# Altium project IS903.PrjPcb
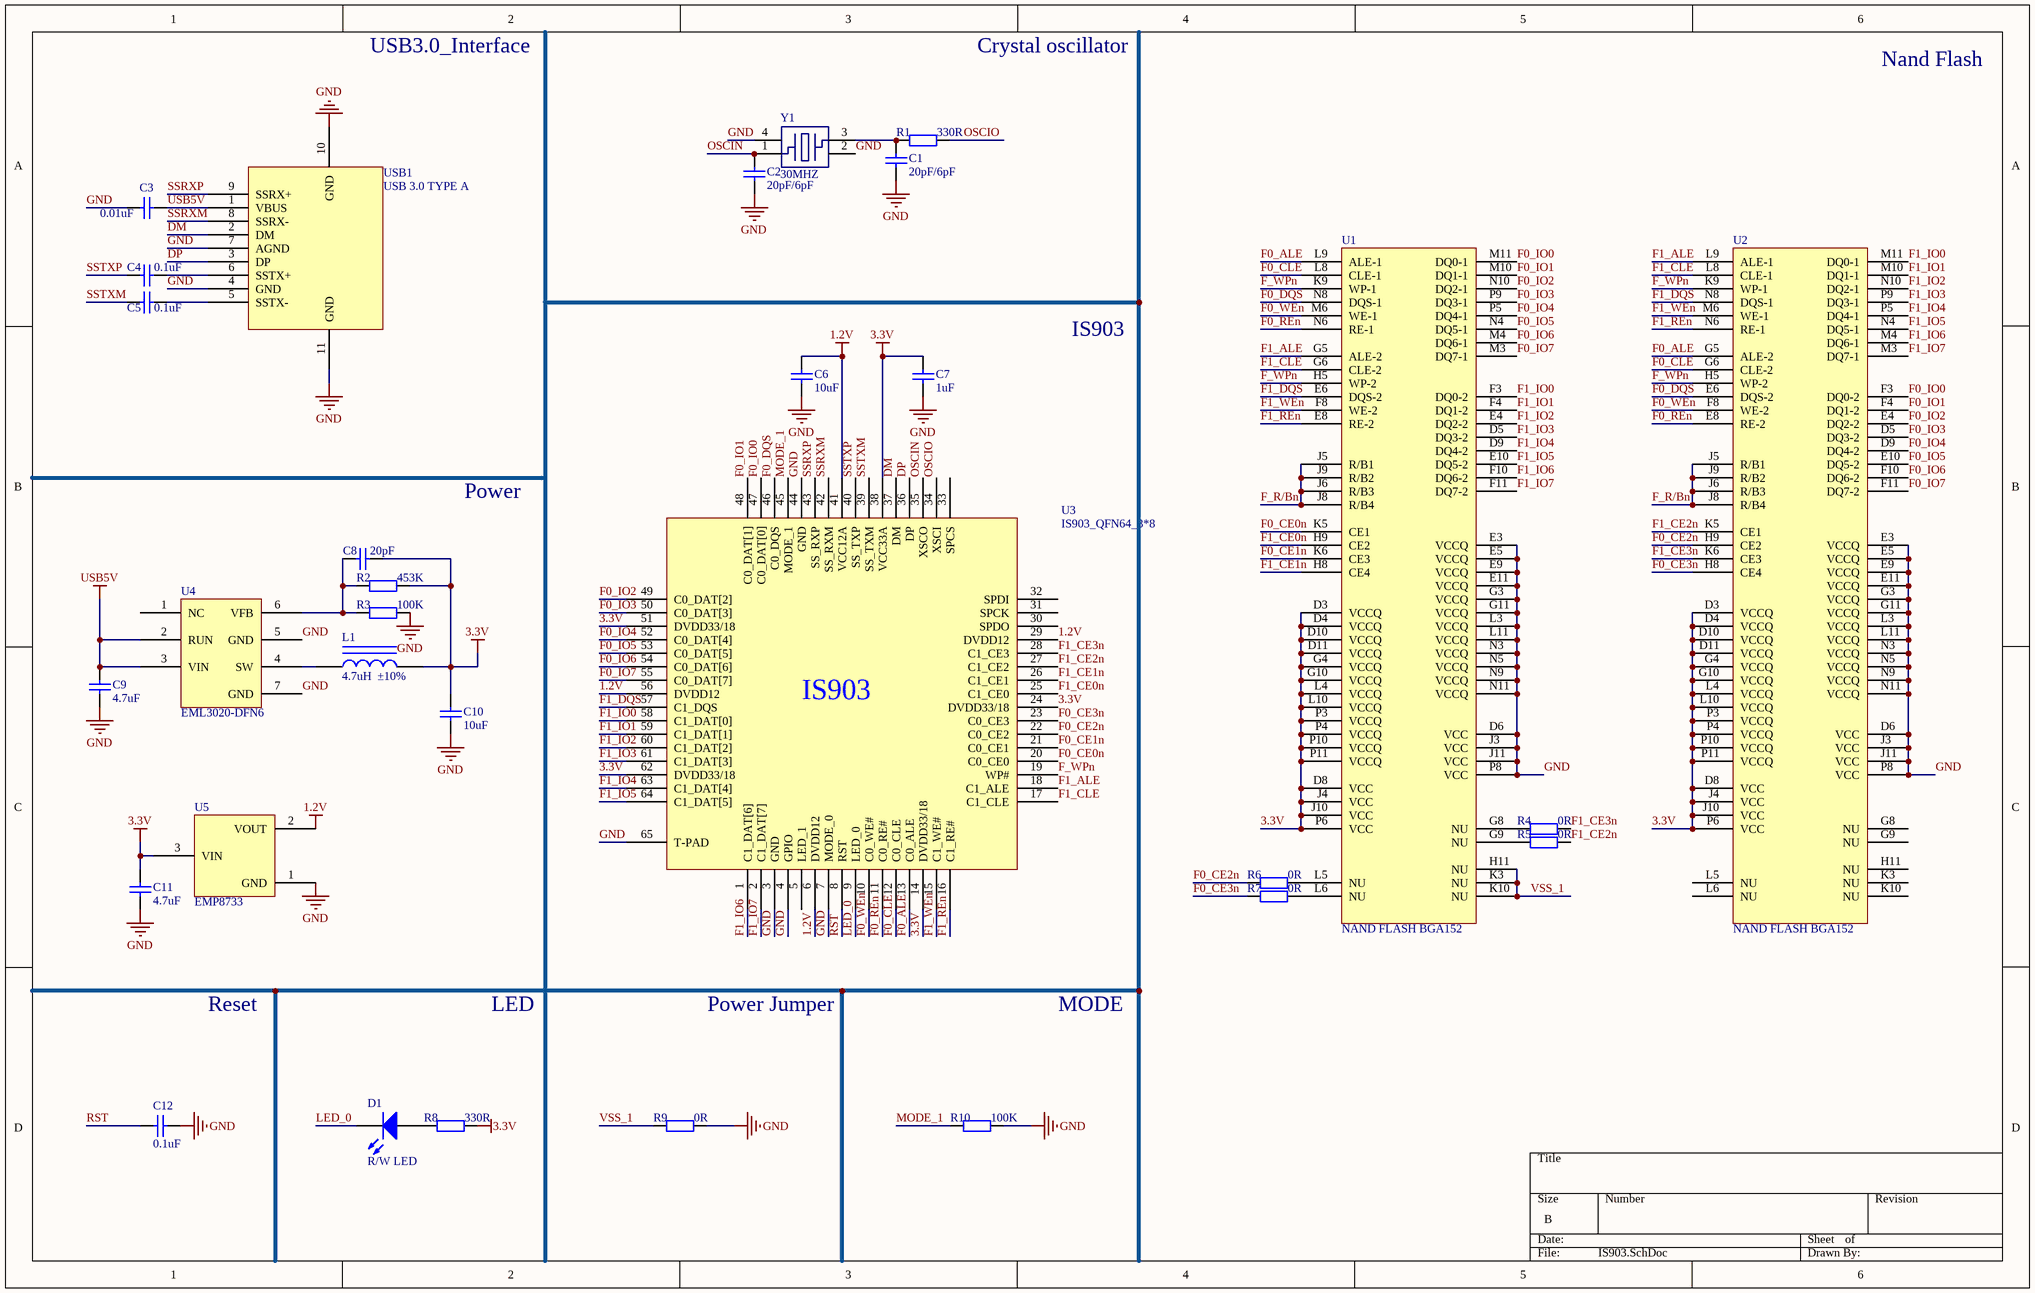
[diagram p0: IS903.SchDoc]
1 sheet, 31 parts. Net scope: global (net labels, ports and power ports of the same name join across sheets).
Board file: IS903_PCB.PcbDoc

## Sheet IS903.SchDoc
size B

### Parts
C1  20pF/6pF  [C 0402_L]
C2  20pF/6pF  [C 0402_L]
C3  0.01uF  [C 0402_L]
C4  0.1uF  [C 0402_L]
C5  0.1uF  [C 0402_L]
C6  10uF  [C 0603_L]
C7  1uF  [C 0402_L]
C8  20pF  [C 0402_L]
C9  4.7uF  [C 0603_L]
C10  10uF  [C 0603_L]
C11  4.7uF  [C 0603_L]
C12  0.1uF  [C 0402_L]
D1  R/W LED  [0603_LED_S1]
L1  4.7uH  ±10%  [LQM2HPN1R0MG0L]
R1  330R  [R 0402_L]
R2  453K  [R 0402_L]
R3  100K  [R 0402_L]
R4  0R  [R 0402_L]
R5  0R  [R 0402_L]
R6  0R  [R 0402_L]
R7  0R  [R 0402_L]
R8  330R  [R 0402_L]
R9  0R  [R 0402_L]
R10  100K  [R 0402_L]
U1  NAND FLASH BGA152  [BGA152]
U2  NAND FLASH BGA152  [BGA152]
U3  IS903_QFN64_8*8  [QFN64 8x8_L]
U4  EML3020-DFN6  [TDFN6]
U5  EMP8733  [SOT23-3L]
USB1  USB 3.0 TYPE A  [USB3.0-G]
Y1  30MHZ  [OSC 2025-4P]

### Nets
1.2V: C6.2 U3.6(DVDD12) U3.29(DVDD12) U3.41(VCC12A) U3.56(DVDD12) U5.2(VOUT)
3.3V: C7.2 C8.1 C10.2 C11.2 L1.2 R2.2 R8.2 U1.D3(VCCQ) U1.D4(VCCQ) U1.D8(VCC) U1.D10(VCCQ) U1.D11(VCCQ) U1.G4(VCCQ) U1.G10(VCCQ) U1.J4(VCC) U1.J10(VCC) U1.L4(VCCQ) U1.L10(VCCQ) U1.P3(VCCQ) U1.P4(VCCQ) U1.P6(VCC) U1.P10(VCCQ) U1.P11(VCCQ) U2.D3(VCCQ) U2.D4(VCCQ) U2.D8(VCC) U2.D10(VCCQ) U2.D11(VCCQ) U2.G4(VCCQ) U2.G10(VCCQ) U2.J4(VCC) U2.J10(VCC) U2.L4(VCCQ) U2.L10(VCCQ) U2.P3(VCCQ) U2.P4(VCCQ) U2.P6(VCC) U2.P10(VCCQ) U2.P11(VCCQ) U3.14(DVDD33/18) U3.24(DVDD33/18) U3.38(VCC33A) U3.51(DVDD33/18) U3.62(DVDD33/18) U5.3(VIN)
GND: C1.2 C2.2 C3.2 C6.1 C7.1 C9.1 C10.1 C11.1 C12.2 R3.2 R9.2 R10.2 U1.D6(VCC) U1.E3(VCCQ) U1.E5(VCCQ) U1.E9(VCCQ) U1.E11(VCCQ) U1.G3(VCCQ) U1.G11(VCCQ) U1.J3(VCC) U1.J11(VCC) U1.L3(VCCQ) U1.L11(VCCQ) U1.N3(VCCQ) U1.N5(VCCQ) U1.N9(VCCQ) U1.N11(VCCQ) U1.P8(VCC) U2.D6(VCC) U2.E3(VCCQ) U2.E5(VCCQ) U2.E9(VCCQ) U2.E11(VCCQ) U2.G3(VCCQ) U2.G11(VCCQ) U2.J3(VCC) U2.J11(VCC) U2.L3(VCCQ) U2.L11(VCCQ) U2.N3(VCCQ) U2.N5(VCCQ) U2.N9(VCCQ) U2.N11(VCCQ) U2.P8(VCC) U3.3(GND) U3.4(GPIO) U3.7(MODE_0) U3.44(GND) U3.65(T-PAD) U4.5(GND) U4.7(GND) U5.1(GND) USB1.4(GND) USB1.7(AGND) USB1.10(GND) USB1.11(GND) Y1.2 Y1.4
USB5V: C3.1 C9.2 U4.2(RUN) U4.3(VIN) USB1.1(VBUS)
DM: U3.37(DM) USB1.2(DM)
DP: U3.36(DP) USB1.3(DP)
F0_ALE: U1.L9(ALE-1) U2.G5(ALE-2) U3.13(C0_ALE)
F0_CE0n: U1.K5(CE1) U3.20(C0_CE0)
F0_CE1n: U1.K6(CE3) U3.21(C0_CE1)
F0_CE2n: R6.1 U2.H9(CE2) U3.22(C0_CE2)
F0_CE3n: R7.1 U2.H8(CE4) U3.23(C0_CE3)
F0_CLE: U1.L8(CLE-1) U2.G6(CLE-2) U3.12(C0_CLE)
F0_DQS: U1.N8(DQS-1) U2.E6(DQS-2) U3.46(C0_DQS)
F0_IO0: U1.M11(DQ0-1) U2.F3(DQ0-2) U3.47(C0_DAT[0])
F0_IO1: U1.M10(DQ1-1) U2.F4(DQ1-2) U3.48(C0_DAT[1])
F0_IO2: U1.N10(DQ2-1) U2.E4(DQ2-2) U3.49(C0_DAT[2])
F0_IO3: U1.P9(DQ3-1) U2.D5(DQ3-2) U3.50(C0_DAT[3])
F0_IO4: U1.P5(DQ4-1) U2.D9(DQ4-2) U3.52(C0_DAT[4])
F0_IO5: U1.N4(DQ5-1) U2.E10(DQ5-2) U3.53(C0_DAT[5])
F0_IO6: U1.M4(DQ6-1) U2.F10(DQ6-2) U3.54(C0_DAT[6])
F0_IO7: U1.M3(DQ7-1) U2.F11(DQ7-2) U3.55(C0_DAT[7])
F0_REn: U1.N6(RE-1) U2.E8(RE-2) U3.11(C0_RE#)
F0_WEn: U1.M6(WE-1) U2.F8(WE-2) U3.10(C0_WE#)
F1_ALE: U1.G5(ALE-2) U2.L9(ALE-1) U3.18(C1_ALE)
F1_CE0n: U1.H9(CE2) U3.25(C1_CE0)
F1_CE1n: U1.H8(CE4) U3.26(C1_CE1)
F1_CE2n: R5.2 U2.K5(CE1) U3.27(C1_CE2)
F1_CE3n: R4.2 U2.K6(CE3) U3.28(C1_CE3)
F1_CLE: U1.G6(CLE-2) U2.L8(CLE-1) U3.17(C1_CLE)
F1_DQS: U1.E6(DQS-2) U2.N8(DQS-1) U3.57(C1_DQS)
F1_IO0: U1.F3(DQ0-2) U2.M11(DQ0-1) U3.58(C1_DAT[0])
F1_IO1: U1.F4(DQ1-2) U2.M10(DQ1-1) U3.59(C1_DAT[1])
F1_IO2: U1.E4(DQ2-2) U2.N10(DQ2-1) U3.60(C1_DAT[2])
F1_IO3: U1.D5(DQ3-2) U2.P9(DQ3-1) U3.61(C1_DAT[3])
F1_IO4: U1.D9(DQ4-2) U2.P5(DQ4-1) U3.63(C1_DAT[4])
F1_IO5: U1.E10(DQ5-2) U2.N4(DQ5-1) U3.64(C1_DAT[5])
F1_IO6: U1.F10(DQ6-2) U2.M4(DQ6-1) U3.1(C1_DAT[6])
F1_IO7: U1.F11(DQ7-2) U2.M3(DQ7-1) U3.2(C1_DAT[7])
F1_REn: U1.E8(RE-2) U2.N6(RE-1) U3.16(C1_RE#)
F1_WEn: U1.F8(WE-2) U2.M6(WE-1) U3.15(C1_WE#)
F_R/Bn: U1.J5(R/B1) U1.J6(R/B3) U1.J8(R/B4) U1.J9(R/B2) U2.J5(R/B1) U2.J6(R/B3) U2.J8(R/B4) U2.J9(R/B2)
F_WPn: U1.H5(WP-2) U1.K9(WP-1) U2.H5(WP-2) U2.K9(WP-1) U3.19(WP#)
LED_0: D1.K U3.9(LED_0)
MODE_1: R10.1 U3.45(MODE_1)
OSCIN: C2.1 U3.35(XSCO) Y1.1
OSCIO: R1.2 U3.34(XSCI)
RST: C12.1 U3.8(RST)
SSRXM: U3.42(SS_RXM) USB1.8(SSRX-)
SSRXP: U3.43(SS_RXP) USB1.9(SSRX+)
SSTXM: C5.2 U3.39(SS_TXM)
SSTXP: C4.2 U3.40(SS_TXP)
VSS_1: R9.1 U1.H11(NU) U1.K3(NU) U1.K10(NU)
NetC1_1: C1.1 R1.1 Y1.3
NetC4_1: C4.1 USB1.6(SSTX+)
NetC5_1: C5.1 USB1.5(SSTX-)
NetC8_2: C8.2 R2.1 R3.1 U4.6(VFB)
NetD1_A: D1.A R8.1
NetL1_1: L1.1 U4.4(SW)
NetR4_1: R4.1 U1.G8(NU)
NetR5_1: R5.1 U1.G9(NU)
NetR6_2: R6.2 U1.L5(NU)
NetR7_2: R7.2 U1.L6(NU)

Not connected (* = marked no-connect by the designer): U2 G8(NU) G9(NU) H11(NU) K3(NU) K10(NU) L5(NU) L6(NU); U3 5(LED_1) 30(SPDO) 31(SPCK) 32(SPDI) 33(SPCS); U4 1(NC)

### Notes on the sheet
- USB3.0_Interface
- Crystal oscillator
- Nand Flash
- IS903
- Power
- Reset
- LED
- Power Jumper
- MODE
- (in symbol IS903_QFN64_8*8) IS903

### Library data of the parts
C1-C5 C8 C12 = 0402 2.2nF (222) 10% 50V: 贴片电容; ComponentLink1Description: 供应商链接; ComponentLink1URL: http://www.szlcsc.com/product/details_1883.html; Package: 0402; Supplier: LC; SuppliersPartNumber: C1531
C6 C7 C9-C11 = 0603 100nF (104) 10% 50V: 贴片电容; ComponentLink1Description: 供应商链接; ComponentLink1URL: http://www.szlcsc.com/product/details_15331.html; Package: 0603; Supplier: LC; SuppliersPartNumber: C14663
D1 = 0603 蓝灯: 发光二极管; ComponentLink1Description: 供应商链接; ComponentLink1URL: http://www.szlcsc.com/product/details_73150.html; Package: 0603; Supplier: LC; SuppliersPartNumber: C72041
L1 = 1206 4.7uH  10%: 贴片电感; ComponentLink1Description: 供应商链接; ComponentLink1URL: http://www.szlcsc.com/product/details_1401.html; Package: 1206; Supplier: LC; SuppliersPartNumber: C1049
R1-R10 = 0402 22Ω (22R0) 1%: 贴片电阻; ComponentLink1Description: 供应商链接; ComponentLink1URL: http://www.szlcsc.com/product/details_25835.html; Package: 0402; Supplier: LC; SuppliersPartNumber: C25092
Y1 = 晶振